# Altium schematic sheet 5-PWR_ADC2.SCHDOC
size A4
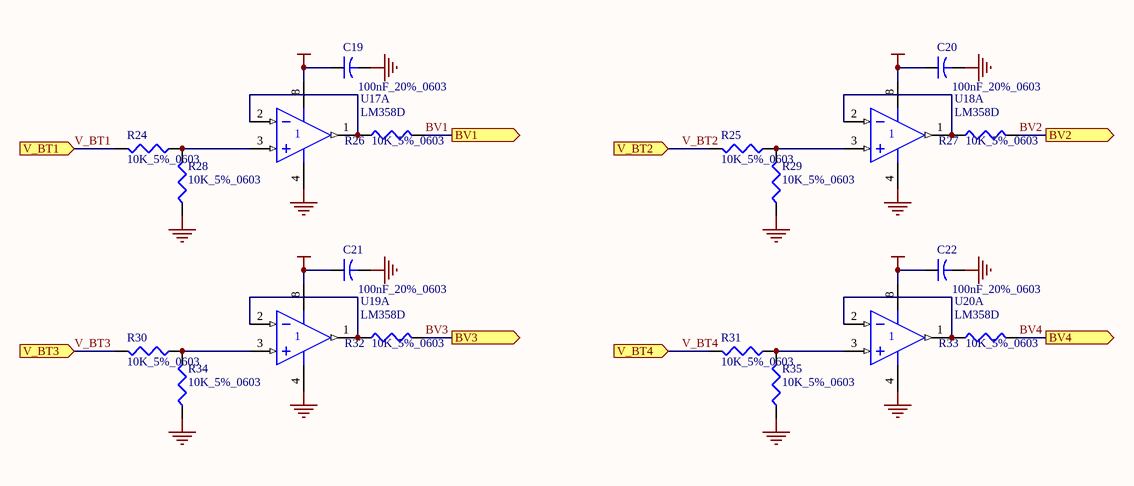
[diagram p0: 5-PWR_ADC2.SCHDOC]

## Parts
C19  100nF_20%_0603  [C1608-0603]
C20  100nF_20%_0603  [C1608-0603]
C21  100nF_20%_0603  [C1608-0603]
C22  100nF_20%_0603  [C1608-0603]
R24  10K_5%_0603  [C1608-0603]
R25  10K_5%_0603  [C1608-0603]
R26  10K_5%_0603  [C1608-0603]
R27  10K_5%_0603  [C1608-0603]
R28  10K_5%_0603  [C1608-0603]
R29  10K_5%_0603  [C1608-0603]
R30  10K_5%_0603  [C1608-0603]
R31  10K_5%_0603  [C1608-0603]
R32  10K_5%_0603  [C1608-0603]
R33  10K_5%_0603  [C1608-0603]
R34  10K_5%_0603  [C1608-0603]
R35  10K_5%_0603  [C1608-0603]
U17  LM358D  [751-02]  (part A of 2)
U18  LM358D  [751-02]  (part A of 2)
U19  LM358D  [751-02]  (part A of 2)
U20  LM358D  [751-02]  (part A of 2)

## Ports
BV1 (out), BV2 (out), BV3 (out), BV4 (out), V_BT1 (in), V_BT2 (in), V_BT3 (in), V_BT4 (in)

## Nets
GND: C19.2 C20.2 C21.2 C22.2 R28.1 R29.1 R34.1 R35.1 U17.4(V-) U18.4(V-) U19.4(V-) U20.4(V-)
VCC_5V: C19.1 C20.1 C21.1 C22.1 U17.8(V+) U18.8(V+) U19.8(V+) U20.8(V+)
BV1: R26.2 ; port BV1
BV2: R27.2 ; port BV2
BV3: R32.2 ; port BV3
BV4: R33.2 ; port BV4
V_BT1: R24.2 ; port V_BT1
V_BT2: R25.2 ; port V_BT2
V_BT3: R30.2 ; port V_BT3
V_BT4: R31.2 ; port V_BT4
NetR24_1: R24.1 R28.2 U17.3(IN+)
NetR25_1: R25.1 R29.2 U18.3(IN+)
NetR26_1: R26.1 U17.1(OUT) U17.2(IN-)
NetR27_1: R27.1 U18.1(OUT) U18.2(IN-)
NetR30_1: R30.1 R34.2 U19.3(IN+)
NetR31_1: R31.1 R35.2 U20.3(IN+)
NetR32_1: R32.1 U19.1(OUT) U19.2(IN-)
NetR33_1: R33.1 U20.1(OUT) U20.2(IN-)

## Library data of the parts
C19-C22 = Cap2: Capacitor; Value: 0.1uF 20% 0603; Published: 23-Sep-2002; Publisher: Altium Limited
R24-R35 = Res3: Resistor; Value: 150R %5 0603; Published: 8-Jun-2000; Revision: July-2002: Re-released for DXP Platform.; Publisher: Altium Limited
U17-U20 = LM358D: Dual Low-Power Operational Amplifier; Published: 17-Jul-2002; DatasheetDocument: 1988; PackageReference: 751-02; Publisher: Altium Limited; Code_JEDEC: MS-012-AA; Code_IPC: SO8